# EAGLE design Adafruit MCP73871 Solar Charger v4 (EAGLE 6.3)
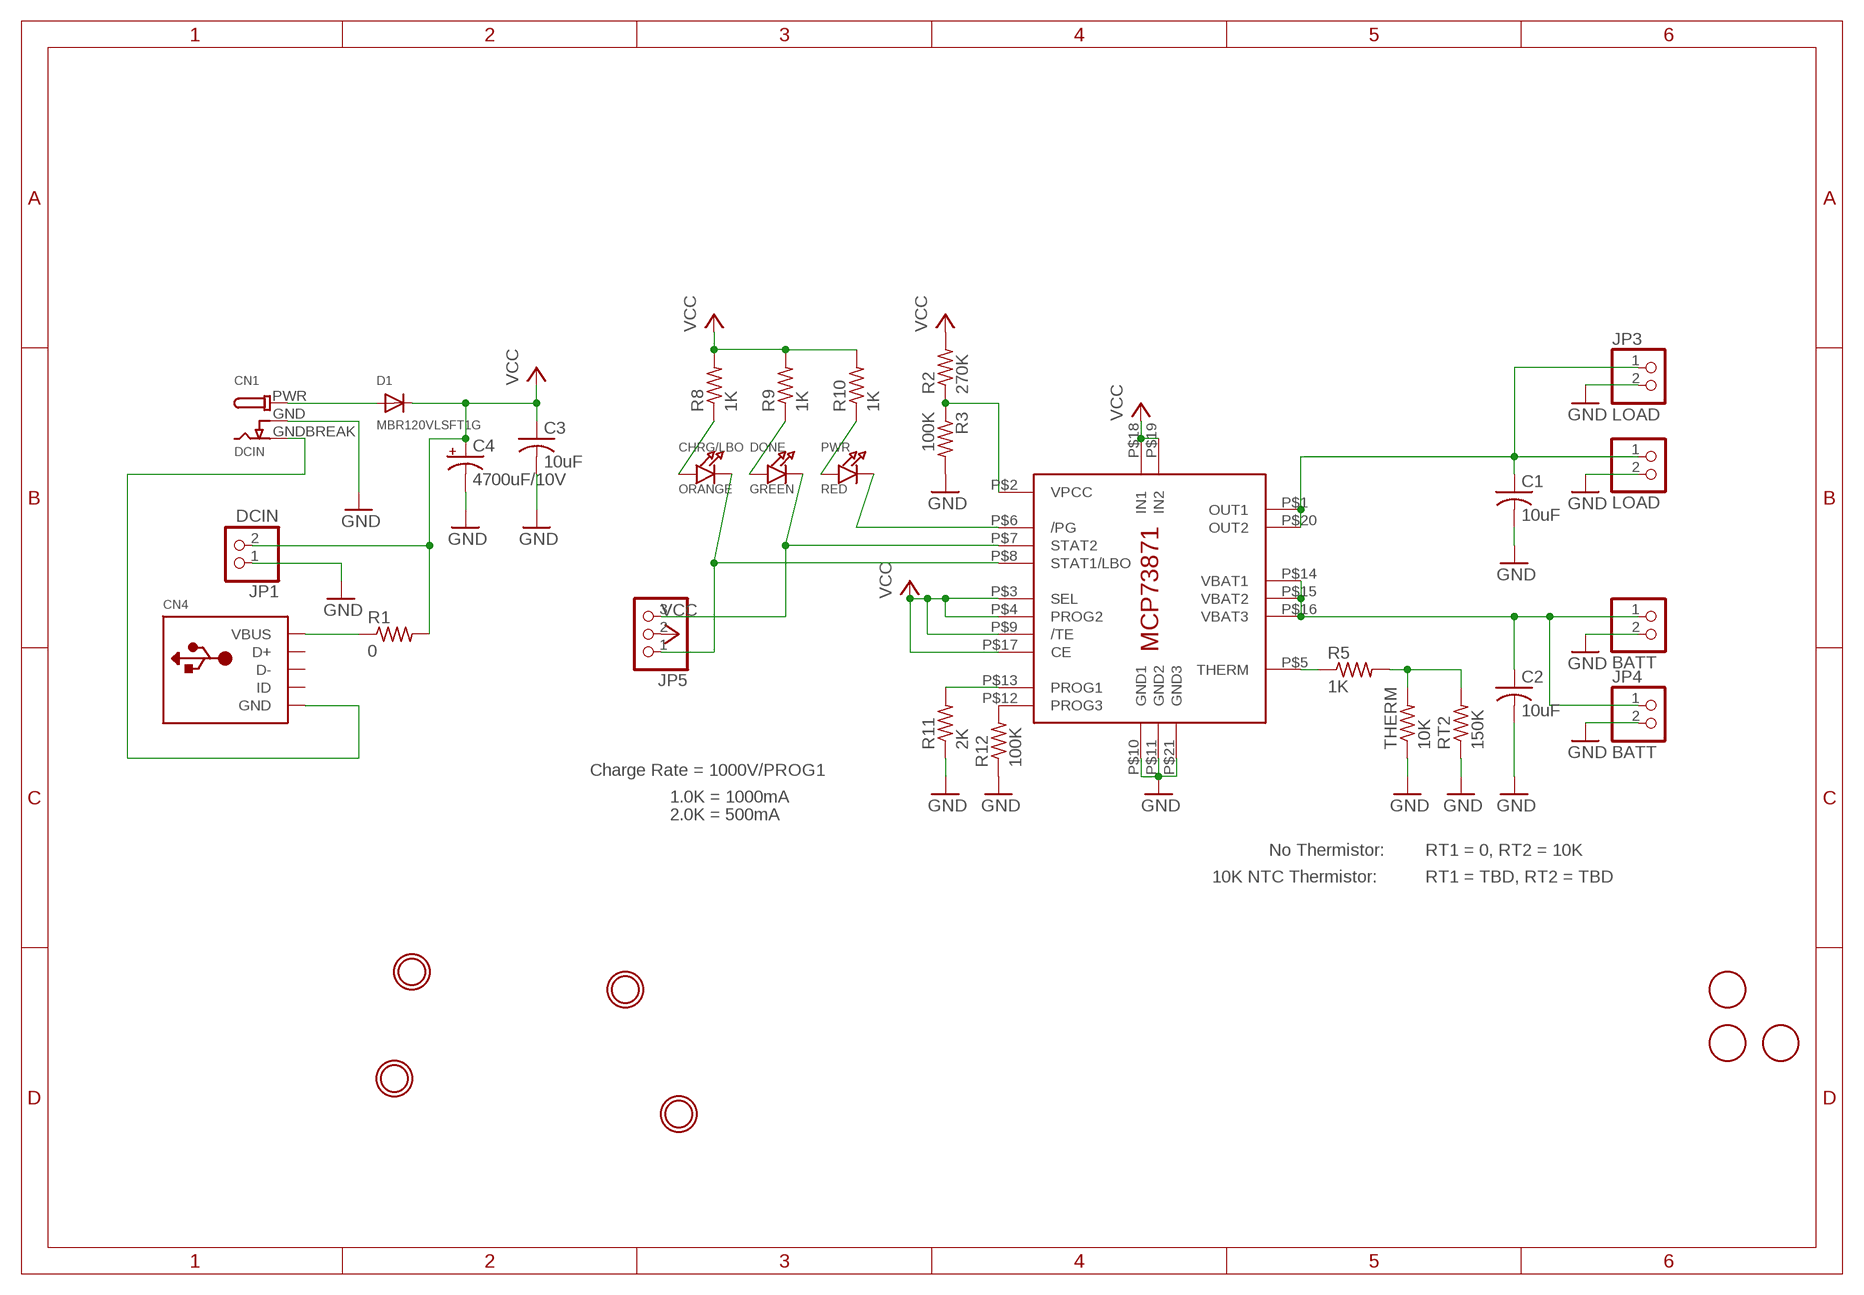
[diagram p0: schematic, sheet 1]

## Parts
BATT  JST_2PIN-SMT-RA  [JST-PH-2-SMT-RA]
C1  10uF  C-USC0805K  [C0805K]
C2  10uF  C-USC0805K  [C0805K]
C3  10uF  C-USC0805K  [C0805K]
C4  4700uF/10V  CPOL-USE5-13  [E5-13]
CHRG/LBO  ORANGE  LED0805_NOOUTLINE  [CHIPLED_0805_NOOUTLINE]
CN1  DCIN  DCBARRELSMT  [DCJACK_2MM_SMT]
CN4  USBMINIBLARGE  [USB-MINIB_LARGER]
D1  MBR120VLSFT1G  DIODESOD-123  [SOD-123]
DONE  GREEN  LED0805_NOOUTLINE  [CHIPLED_0805_NOOUTLINE]
IC1  MCP73871  [QFN20_4MM]
JP1  DCIN  HEADER-1X2  [1X02_OVAL]
JP3  LOAD  HEADER-1X2ROUND  [1X02_ROUND]
JP4  BATT  HEADER-1X2ROUND  [1X02_ROUND]
JP5  PINHD-1X3CB  [1X03-CLEANBIG]
LOAD  JST_2PIN-SMT-RA  [JST-PH-2-SMT-RA]
PWR  RED  LED0805_NOOUTLINE  [CHIPLED_0805_NOOUTLINE]
R1  0  R-US_R0805  [R0805]
R2  270K  R-US_R0805  [R0805]
R3  100K  R-US_R0805  [R0805]
R5  1K  R-US_M0805  [M0805]
R8  1K  R-US_R0805  [R0805]
R9  1K  R-US_R0805  [R0805]
R10  1K  R-US_R0805  [R0805]
R11  2K  R-US_FLIPFLOP  [0805-THM]
R12  100K  R-US_R0805  [R0805]
RT2  150K  R-US_M0805  [M0805]
THERM  10K  R-US_FLIPFLOP  [0805-THM]
U$2  FIDUCIAL  [FIDUCIAL_1MM]
U$3  FIDUCIAL  [FIDUCIAL_1MM]
U$4  MOUNTINGHOLE2.5  [MOUNTINGHOLE_2.5_PLATED]
U$5  MOUNTINGHOLE2.5  [MOUNTINGHOLE_2.5_PLATED]
U$6  MOUNTINGHOLE2.5  [MOUNTINGHOLE_2.5_PLATED]
U$7  MOUNTINGHOLE2.5  [MOUNTINGHOLE_2.5_PLATED]
U$8  FIDUCIAL  [FIDUCIAL_1MM]

## Nets
BATT: BATT.1 C2.1 IC1.P$14(VBAT1) IC1.P$15(VBAT2) IC1.P$16(VBAT3) JP4.1
GND: BATT.2 C1.2 C2.2 C3.2 C4.- CN1.GND(GNDBREAK) IC1.P$10(GND1) IC1.P$11(GND2) IC1.P$21(GND3) JP1.1 JP3.2 JP4.2 LOAD.2 R3.2 R11.1 R12.1 RT2.1 THERM.1
N$1: IC1.P$6(/PG) PWR.C
N$2: CN4.VBUS R1.1
N$3: CN1.GNDBREAK(GND) CN4.GND CN4.GND1(GND) CN4.GND2(GND) CN4.GND3(GND) CN4.GND4(GND)
N$4: DONE.C IC1.P$7(STAT2) JP5.3
N$5: IC1.P$5(THERM) R5.1
N$6: IC1.P$2(VPCC) R2.1 R3.1
N$8: R5.2 RT2.2 THERM.2
N$10: CN1.PWR D1.A
N$11: CHRG/LBO.C IC1.P$8(STAT1/LBO) JP5.1
N$12: CHRG/LBO.A R8.1
N$13: DONE.A R9.1
N$14: PWR.A R10.1
N$15: IC1.P$12(PROG3) R12.2
N$16: IC1.P$13(PROG1) R11.2
OUT: C1.1 IC1.P$1(OUT1) IC1.P$20(OUT2) JP3.1 LOAD.1
VCC: C3.1 C4.+ D1.C IC1.P$3(SEL) IC1.P$4(PROG2) IC1.P$9(/TE) IC1.P$17(CE) IC1.P$18(IN1) IC1.P$19(IN2) JP1.2 JP5.2 R1.2 R2.2 R8.2 R9.2 R10.2
Unconnected: CN4.D+ CN4.D- CN4.ID

## Notes on the sheet
- Charge Rate = 1000V/PROG1
- 1.0K = 1000mA
- 2.0K = 500mA
- No Thermistor: | RT1 = 0, RT2 = 10K
- 10K NTC Thermistor: | RT1 = TBD, RT2 = TBD

## Library data of the parts
BATT LOAD = adafruit:JST_2PIN: JST 2-Pin Connectors of various flavors SMT-RA (S2B-PH-SM4) 4UConnector #17311 SMT (B2B-PH-SM4) THM-RA (S2B-PH) THM (B2B-PH)
C1-C3 = adafruit:C-US: CAPACITOR, American symbol
C4 = adafruit:CPOL-US: POLARIZED CAPACITOR, American symbol
CHRG/LBO DONE PWR = microbuilder:LED: LED 0603 - 0603 Surface Mount Package 2mA: Green LED - Low Power (3.9mcd, 2ma, 1.7Vf) - Digikey: 475-2709-2-ND Orange LED - Low Power (9.8mcd, 2ma, 1.8Vf) - Digikey: 475-1194-2-ND Red LED - Low Power (5mcd, 2ma, 1.8Vf) - Digikey: 475-1195-2-ND Yellow LED - Low Power (7mcd, 2ma, 1.8Vf) - Digikey: 475-1196-2-ND 5mA: Blue LED - Low Power (17mcd, 5ma, 2.9Vf) - Digikey: LNJ937W8CRACT-ND 0805 - 0805 Surface Mount Package 2mA: Red LED (8.8mcd, 2mA, 1.8Vf, Clear) - Low Power [Digikey: 475-2510-1-ND] Green LED (5mcd, 2mA, 1.8Vf, Clear) - Low Power [Digikey: 475-2730-1-ND] Yellow LED (11.3mcd, 2mA, 1.8Vf, Clear) - Low Power [Digikey: 475-2555-1-ND] 20mA: Red LED (104mcd, 20mA, Diffused) - LS R976 [Digikey: 475-1278-6-ND] Red LED (12mcd, 20mA, 2.0Vf, Clear) - APT2012EC [Digikey: 754-1128-1-ND] Green LED (15mcd, 20mA, 2.2Vf, Clear) - APT2012GC [Digikey: 754-1131-1-ND] Orange LED (160mcd, 20mA, 2.1Vf, Clear) - APT2012SECK [Digikey: 754-1130-1-ND] 1206 - 1206 Surface Mount Package Green LED (26mcd, 20mA, Diffused) - LG N971 [Digikey: 475-1407-6-ND] Red LED (15mcd, 20mA, Diffused) - LH N974 [Digikey: 475-1416-6-ND] Cree - Cree High-Power Surface Mount LEDs XPEBWT-L1-0000-00D50 - White 111lm 350mA 2.9Vf 6200K 110° XTEAWT-00-0000-00000LEE3 - White 114lm 350mA 2.85Vf 5000K 115° Everlight - Everlight 45-21 Series Surface Mount LEDs 45-21/QK2C-B2832AC2CB2/2T - Warm White 2000mcd 20mA 3.25Vf 3050K 120° 45-21/LK2C-B38452C4CB2/2T - Nuetral White 2000mcd 20mA 3.25Vf 4150K 120° 45-21/LK2C-B50634C6CB2/2T - Cold White 2200mcd 20mA 3.25Vf 5650K 120° PLCC2 Reverse Mount LS T77K-J1L2-1-0-2-R18-Z - Red 11.25mcd 2mA 1.8Vf 630nm 120° LO T77K-L1M2-24-Z - Orange 19.6mcd 2mA 1.8Vf 606nm 120° LY T77K-K2M1-26-Z - Yellow 15.7mcd 2mA 1.8Vf 587nm 120°
CN1 = microbuilder:DCBARREL: DC Barrel Jack DCJACK_1.3MM_PTH - Through Hole 1.3mm Jack (4UConnector: 05536) DCJACK_2MM_PTH - Through Hole 2.0/2.1 Jack (4UConnector: 05537) DCJACK_2MM_SMT - SMT 2.0/2.1mm Jack(4UConnector: 03267)
CN4 = microbuilder:USB: USB Connectors USBMINIB - Surface Mount Female Mini-B USB Connector 4UConnector: 06564
D1 = microbuilder:DIODE: Diode SMA Model Volts Amps Type Vf Vr Digikey # Notes SSA34-E3 40V 3A Schottky 480mV @ 3A 200uA @ 40V SSA34-E3/61TGITR-ND CDBA120-G 20V 1A Schottky 500mV @ 1A 500uA @ 20V 641-1014-6-ND REEL MBRA210 10V 2A Schottky 350mV @ 2A 700uA @ 10V MBRA210LT3 SOD-123 Model Volts Amps Type Vf Vr Order # Notes BAT54T1G 30V 200mA Schottky 800mV @ 200mA 2uA @ 25V BAT54T1GOSTR-ND B0530W 30V 500mA Schottky 430mV @ 500mA 130uA @ 30V B0530W-FDICT-ND REEL MBR120 20V 1A Schottky 340mV @ 1A MBR120VLSFT1GOSCT-ND SOD-323 Model Volts Amps Type Vf Vr Order # Notes PMEG2005EJ 20V 500mA Schottky 355mV @ 500mA 568-4110-1-ND ZLLS410 10V 570mA Schottky 380mV @ 570mA ZLLS410CT-ND 1N4148WS 75V 150mA Silicon/Simple 1V 1N4148WSFSCT-ND REEL SOD-523 Model Volts Amps Type Vf Vr Order # Notes BAT54XV2 30V 200mA Schottky 0.8V @ 100mA BAT54XV2CT-ND TB751S 30V 30mA Schottky RB751S-40TE61CT-ND SOT23-R/W (R = Solder Paste/Reflow Ovens, W = Hand-Soldering) Model Volts Amps Type Vf Vr Order # Notes BAT54FILM 40V 300mA Schottky 497-7162-1-ND
IC1 = adafruit:MCP73871
JP1 JP3 JP4 = microbuilder:HEADER-1X2: PIN HEADER
JP5 = adafruit:PINHD-1X3: PIN HEADER
R1-R3 R5 R8-R12 RT2 THERM = adafruit:R-US_: RESISTOR, American symbol
U$2 U$3 U$8 = adafruit:FIDUCIAL: For use by pick and place machines to calibrate the vision/machine, 1mm By microbuilder.eu
U$4-U$7 = microbuilder:MOUNTINGHOLE: Mounting Hole For #2 screws (0.086"/2.18mm width, 0.094"/2.4mm hole) use 2.5mm

## Board
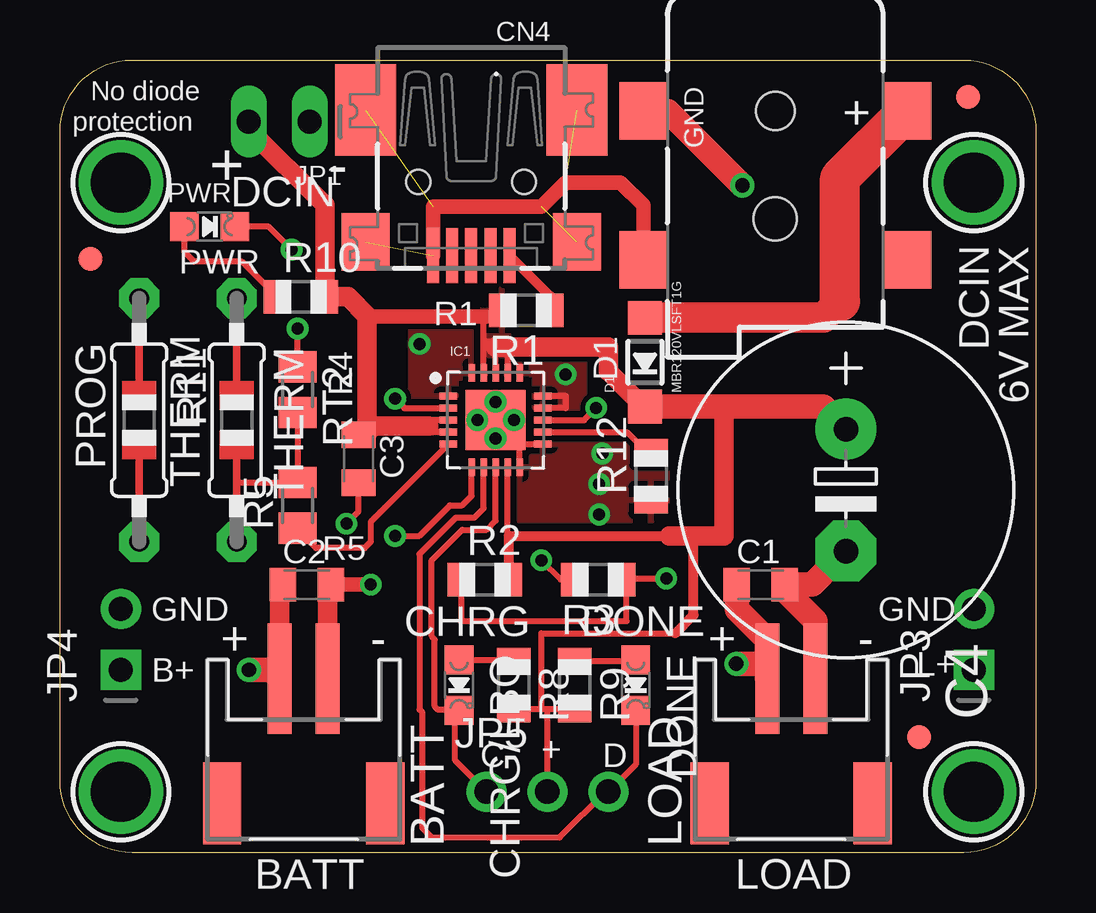
[diagram p1: board, top side]
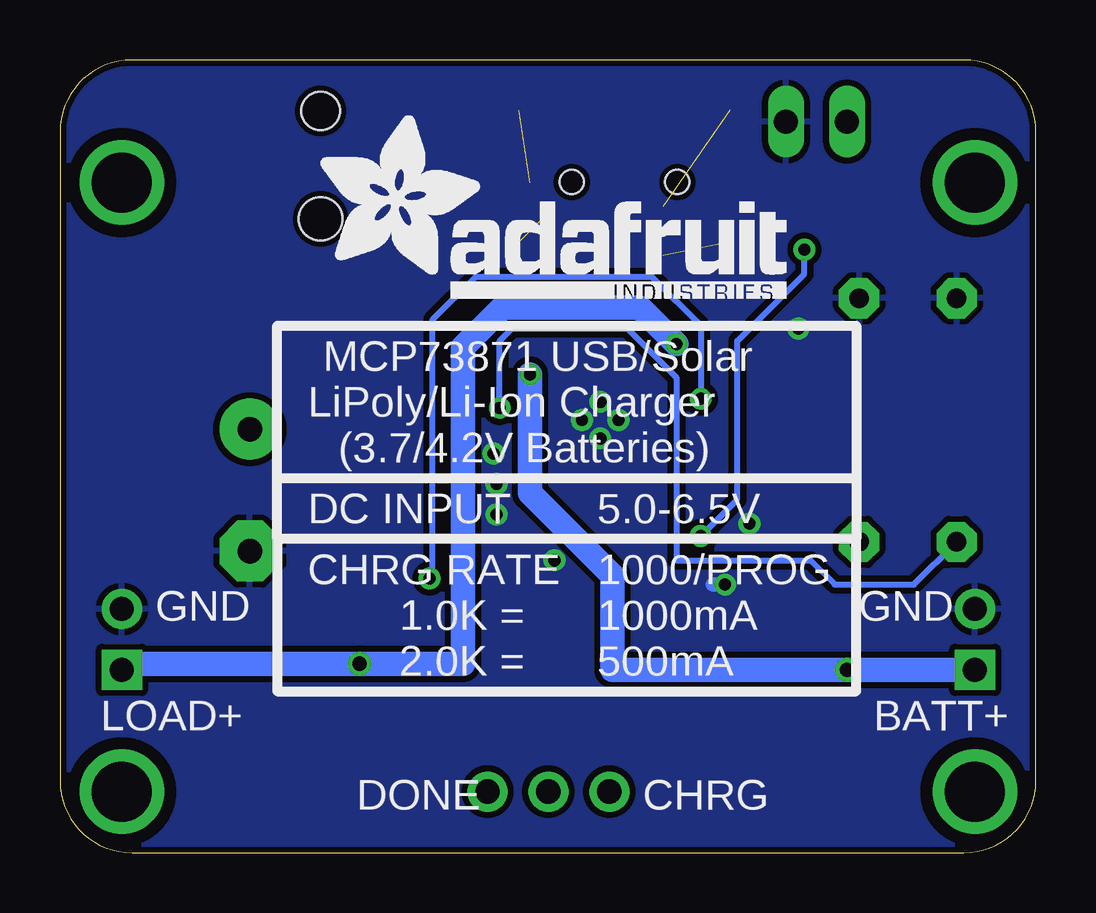
[diagram p2: board, bottom side, seen from below]

Size 40.68 x 33.05 mm. Coordinates in mm from the lower left corner, seen from the top.
Outline: 0,3 0,30.05 arc-90 3,33.05 37.68,33.05 arc-90 40.68,30.05 40.68,3 arc-90 37.68,0 3,0 arc-90 0,3
Copper layers (1*16): Top 0.035mm / dielectric 1.5mm / Bottom 0.035mm
Design rules "default *": minimum track width 8mil, minimum drill 15mil, track to track 8mil, track to pad 8mil, pad to pad 8mil, via to via 8mil, smd to smd 8mil, copper to edge 1mil, drill to drill 8mil, minimum pad ring 10mil, minimum via ring 8mil, stop-mask expansion 4mil, vias tented up to drill 24mil, thermal gap 10mil
tRestrict: area 16,17.7 to 16.4,17.8; 9 lines

### Footprints (pad centres in the part's own frame; a part is rotated, then mirrored left to right if it is on the bottom)
JST-PH-2-SMT-RA = smd 1 x 4.6: 1 1,-3.7; 2 -1,-3.7 | smd 1.6 x 3.4: NC1 -3.4,1.5; NC2 3.4,1.5
C0805K = smd 1.1 x 1.4: 1 -1,0; 2 1,0
E5-13 = drill 1.016 pad 2.54: + -2.54,0 | drill 1.016 pad 2.54 octagon: - 2.54,0
CHIPLED_0805_NOOUTLINE = smd 1.2 x 1.2: A 0,-1.05; C 0,1.05
DCJACK_2MM_SMT = smd 2.4 x 2: GND 0,-5.5; GNDBREAK 6.2,-5.5; PWR 0,5.5; PWR2 6.2,5.5 | hole 1.6: 0,0 | hole 1.8: 4.5,0
USB-MINIB_LARGER = smd 0.5 x 2.308: D+ 0,4.064; D- -0.8,4.064; GND 1.6,4.064; ID 0.8,4.064; VBUS -1.6,4.064 | smd 2.54 x 3.81: GND1 -4.4,-2; GND4 4.4,-2 | smd 2 x 2.4: GND2 -4.4,3.5; GND3 4.4,3.5 | hole 1: -2.2,1; 2.2,1
SOD-123 = smd 1.4 x 1.4: A 1.85,0; C -1.85,0
QFN20_4MM = smd 0.73 x 0.28: P$1 -1.965,1; P$2 -1.965,0.5; P$3 -1.965,0; P$4 -1.965,-0.5; P$5 -1.965,-1; P$11 1.965,-1; P$12 1.965,-0.5; P$13 1.965,0; P$14 1.965,0.5; P$15 1.965,1 | smd 0.28 x 0.73: P$6 -1,-1.965; P$7 -0.5,-1.965; P$8 0,-1.965; P$9 0.5,-1.965; P$10 1,-1.965; P$16 1,1.965; P$17 0.5,1.965; P$18 0,1.965; P$19 -0.5,1.965; P$20 -1,1.965 | smd 2.5 x 2.5: P$21 0,0
1X02_OVAL = drill 1 long: 1 -1.27,0; 2 1.27,0
1X02_ROUND = drill 1 pad 1.676 square: 1 -1.27,0 | drill 1 pad 1.676: 2 1.27,0
1X03-CLEANBIG = drill 1.016 pad 1.676: 1 -2.54,0; 2 0,0; 3 2.54,0
R0805 = smd 1.1 x 1.4: 1 -1,0; 2 1,0
M0805 = smd 1.3 x 1.6: 1 -0.95,0; 2 0.95,0
0805-THM = drill 0.813 pad 1.676 octagon: 1 -5.08,0; 2 5.08,0
FIDUCIAL_1MM = smd 1 x 1: 1 0,0
MOUNTINGHOLE_2.5_PLATED = drill 2.5 pad 3.2: P$1 0,0

### Placement (x,y rotation side)
BATT  10.16,3.56 180 top
C1  29.21,11.18 0 top
C2  10.29,11.18 0 top
C3  12.45,16.41 270 top
C4  32.77,15.11 270 top
CHRG/LBO  16.64,6.99 180 top
CN1  29.82,30.92 270 top
CN4  17.14,28.96 180 top
D1  24.38,20.45 90 top
DONE  24,6.99 180 top
IC1  18.16,18.03 0 top
JP1  9.14,30.48 180 top
JP3  38.1,8.89 90 top
JP4  2.54,8.89 90 top
JP5  20.32,2.54 0 top
LOAD  30.48,3.56 180 top
PWR  6.24,26.1 270 top
R1  19.43,22.61 180 top
R2  17.72,11.38 0 top
R3  22.43,11.38 180 top
R5  9.91,14.48 90 top
R8  18.92,6.99 270 top
R9  21.46,6.99 270 top
R10  10.05,23.18 0 top
R11  3.3,18.03 270 top
R12  24.64,15.7 90 top
RT2  9.91,19.3 270 top
THERM  7.37,18.03 270 top
U$1  [ADAFRUIT_TEXT_20MM]  29.97,23.11 0 bottom
U$2  1.27,24.77 0 top
U$3  35.81,4.83 0 top
U$4  2.54,2.54 0 top
U$5  38.1,2.54 0 top
U$6  2.54,27.94 0 top
U$7  38.1,27.94 0 top
U$8  37.85,31.5 0 top

### Tracks (layer width: path | path; a pad name or v marks a point on that pad's centre or on a via)
BATT  (via drill 0.5, 0.6)
  Top 0.254: v21.08,19.94 21.08,20.19 | IC1.P$14 21.07,18.53 21.08,18.54 21.08,19.05 20.14,19.05 IC1.P$15
  Top 0.813: BATT.1 9.16,11.18 C2.1
  Top 1.016: v7.87,7.62 8.8,7.62 BATT.1
  Bottom 1.016: v21.08,19.94 21.08,14.99 17.65,11.56 17.65,7.62 v7.87,7.62 JP4.1
  pour Top: 19.18,19.94 19.18,20.95 21.84,20.95 21.84,18.54 19.81,18.54 19.81,19.94
GND  (via drill 0.5, 0.6 pad 1.02)
  Top 0.254: 19.16,17.03 IC1.P$11 | IC1.P$10 19.16,17 | 19.16,17 19.18,17.02 | 20.11,12.14 v20.07,12.19 20.88,11.38 R3.2 | C3.2 12.45,14.22 v11.94,13.72 | RT2.1 v9.91,21.84 | 19.16,17 18.89,17.27 v18.16,17.27
  Top 0.406: IC1.P$21 v18.92,18.03
  Top 0.61: C2.2 v12.95,11.18
  Top 0.813: BATT.2 11.16,11.18 C2.2
  Top 1.016: C4.- 31.37,11.18 C1.2 30.21,10.94 31.5,9.65 31.5,8.38 31.48,8.37 LOAD.2 | CN1.GND 25.34,30.92 v28.45,27.81
  Bottom 0.61: v12.95,11.18 13.46,11.18
  other vias: 22.48,14.1 22.48,15.37 22.61,16.64 18.16,18.8 17.4,18.03
  pour Bottom (isolate 0.254): 0,0 0,33.05 40.68,33.05 40.68,0
  pour Top: 19.18,17.02 25.27,17.02 25.27,13.84 19.18,13.84
N$1  (via drill 0.5)
  Top 0.254: v9.65,25.15 8.7,26.1 PWR.C | v13.97,13.21 14.99,13.21 16.26,14.48 16.76,14.48 17.16,14.88 IC1.P$6
  Bottom 0.254: v13.97,13.21 12.45,14.73 12.45,21.34 9.65,24.13 v9.65,25.15
N$2
  Top 0.406: CN4.VBUS 20.43,23.21 R1.1
N$3  (4 unrouted)
  Top 0.61: CN4.GND 15.54,26.92 20.07,26.92 21.08,27.94 23.37,27.94 24.32,26.99 CN1.GNDBREAK 24.38,24.79
N$4
  Top 0.254: IC1.P$7 17.66,14.36 17.27,13.97 16.51,13.97 14.99,12.45 14.99,5.97 15.11,5.84 15.11,1.02 15.49,0.64 20.83,0.64 22.73,2.54 JP5.3 24,3.68 DONE.C
N$5
  Top 0.254: IC1.P$5 12.95,13.79 12.95,12.95 12.7,12.7 10.67,12.7 9.91,13.46 R5.1
N$6  (via drill 0.5)
  Top 0.254: IC1.P$2 14.36,18.53 v13.97,18.92 | 25,11.43 v25.27,11.43 23.43,11.43 R3.1 23.62,11.38 23.62,9.65 16.72,9.65 R2.1
  Bottom 0.254: v13.97,18.92 13.97,21.97 16,24 23.37,24 25.15,22.23 25.15,11.43 v25.27,11.43
N$8
  Top 0.254: RT2.2 R5.2 7.37,15.43 THERM.2
N$10
  Top 1.27: D1.A 31.82,22.3 32.51,22.99
  Top 1.676: 32.51,22.99 32.51,28.11 CN1.PWR
N$11
  Top 0.254: IC1.P$8 18.16,13.84 17.78,13.46 16.76,13.46 15.49,12.19 15.49,9.02 15.62,8.89 15.62,6.1 15.75,5.97 16.6,5.97 CHRG/LBO.C 16.48,5.77 16.48,3.84 JP5.1
N$12
  Top 0.254: CHRG/LBO.A 18.87,8.04 R8.1
N$13
  Top 0.254: R9.1 23.95,7.99 DONE.A
N$14
  Top 0.254: R10.1 7.59,24.64 5.59,24.64 5.19,25.04 PWR.A
N$15
  Top 0.254: IC1.P$12 23.63,17.53 24.46,16.7 R12.2
N$16  (via drill 0.5)
  Top 0.254: IC1.P$13 21.84,18.03 v22.35,18.54
  Bottom 0.254: v22.35,18.54 22.35,21.34 21.84,21.84 17.02,21.84 14.99,19.81 14.99,12.19 9.4,12.19 8.38,11.18 5.08,11.18 R11.2
OUT  (via drill 0.5, 0.6)
  Top 1.016: C1.1 28.21,10.14 29.46,8.89 29.46,7.87 | 29.46,7.87 v28.19,7.87 | 29.46,7.87 29.46,7.27 LOAD.1
  Bottom 1.016: v14.99,21.21 16.51,22.73 22.23,22.73 23.88,21.08 23.88,7.87 v28.19,7.87 37.97,7.87 38.1,7.75 JP3.1
  pour Top: 17.14,19.81 17.14,21.72 14.61,21.72 14.61,19.05 16.51,19.05 16.51,19.81
VCC
  Top 0.254: IC1.P$9 18.66,11.44 R2.2 | 20.32,5.99 R8.2 20.07,5.99 20.07,9.14 25.65,9.14 | 20.32,5.99 R9.2 | IC1.P$3 15.37,18.03 15.37,17.78 | 18.03,21.08 18.03,21.34 17.66,21.34 IC1.P$19 17.66,22.23 17.78,22.35 | IC1.P$18 18.16,21.08 18.67,21.08 IC1.P$17 | IC1.P$4 14.85,17.53 arc-90 14.61,17.78 | JP5.2 20.32,5.99
  Top 0.406: R2.2 18.72,13.21 25.4,13.21 | 25.65,9.14 26.42,9.91 26.42,13.21
  Top 0.61: 17.78,22.35 12.81,22.35
  Top 0.813: 15.37,17.78 14.61,17.78 13.08,17.78 12.71,17.41 C3.1 12.81,17.78 12.81,22.35 12.81,22.37 12,23.18 R10.2 11.05,26.99 7.87,30.16 JP1.2 | D1.C 24.33,18.6 22.86,20.07 22.86,21.08 18.16,21.08 | 25.4,13.21 26.42,13.21 27.69,13.21 27.69,18.6
  Top 1.016: D1.C 27.69,18.6 31.82,18.6 C4.+
  pour Top: 17.65,19.88 17.65,23.75 18.67,23.75 18.67,19.88
  pour Top: 16.26,18.03 13.59,18.03 13.59,17.53 16.26,17.53

### Text on the board
tPlace: No diode | protection | + | - | DCIN | 6V MAX | PWR | R1 | DCIN | D1 | R4 | PROG | THERM | R5 | GND | GND | CHRG | DONE | L+ | B+ | C | + | D | BATT | LOAD
bPlace: MCP73871 USB/Solar | LiPoly/Li-Ion Charger | (3.7/4.2V Batteries) | 5.0-6.5V | DC INPUT | GND | 1000/PROG | CHRG RATE | GND | 1000mA | 1.0K = | 500mA | 2.0K = | BATT+ | LOAD+ | CHRG | DONE